# Altium schematic sheet 2012_BALISE_CARTE_PRINCIPALE.SchDoc
size 817 x 513 mm
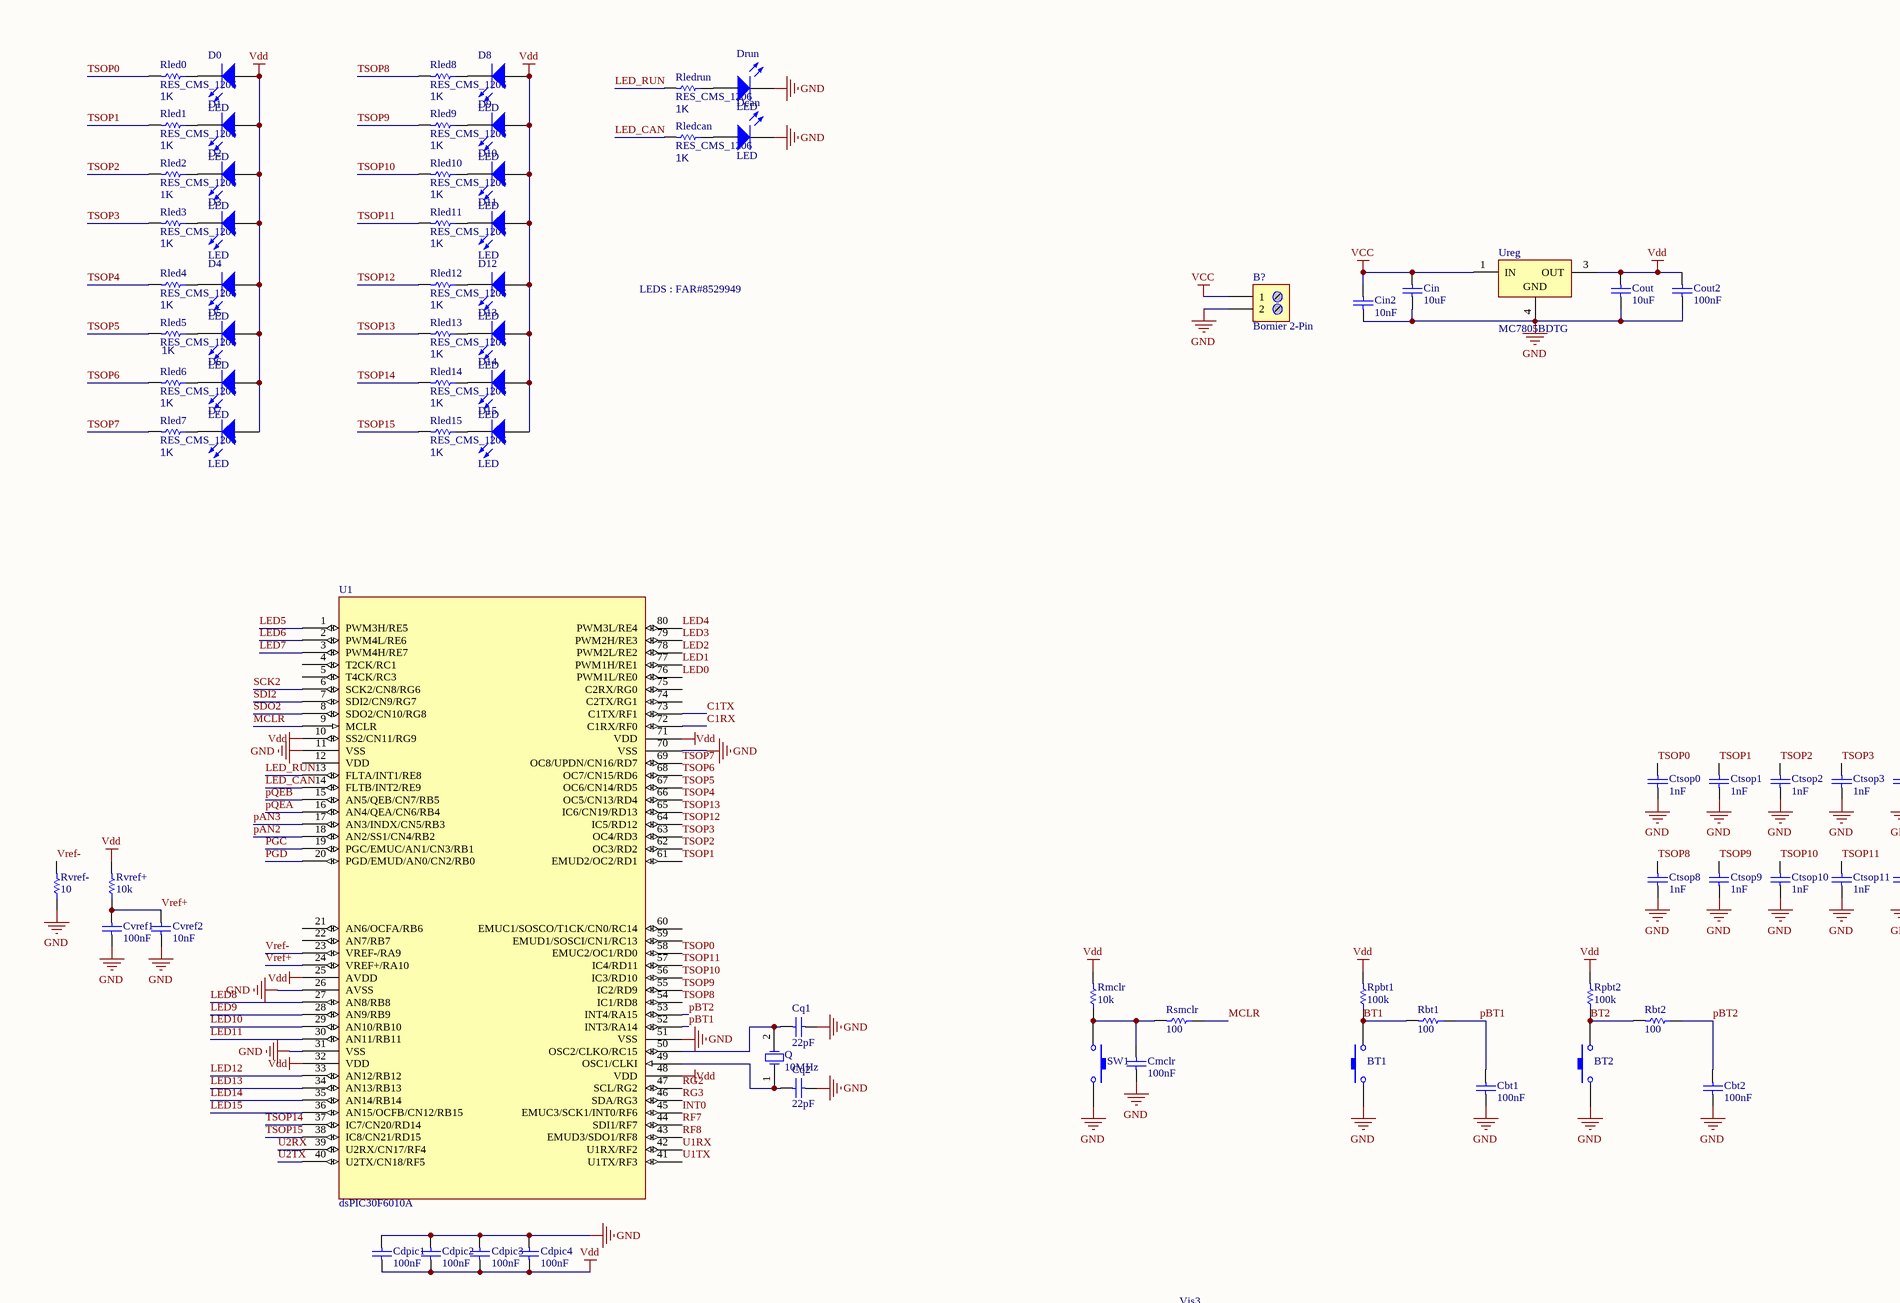
[diagram p0: 2012_BALISE_CARTE_PRINCIPALE.SchDoc, top left]
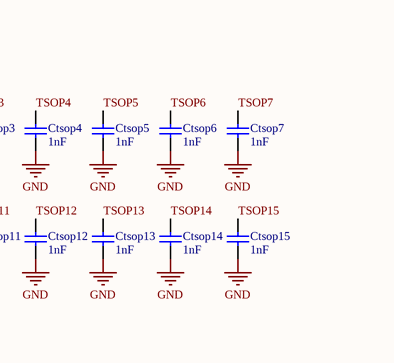
[diagram p1: 2012_BALISE_CARTE_PRINCIPALE.SchDoc, top right]
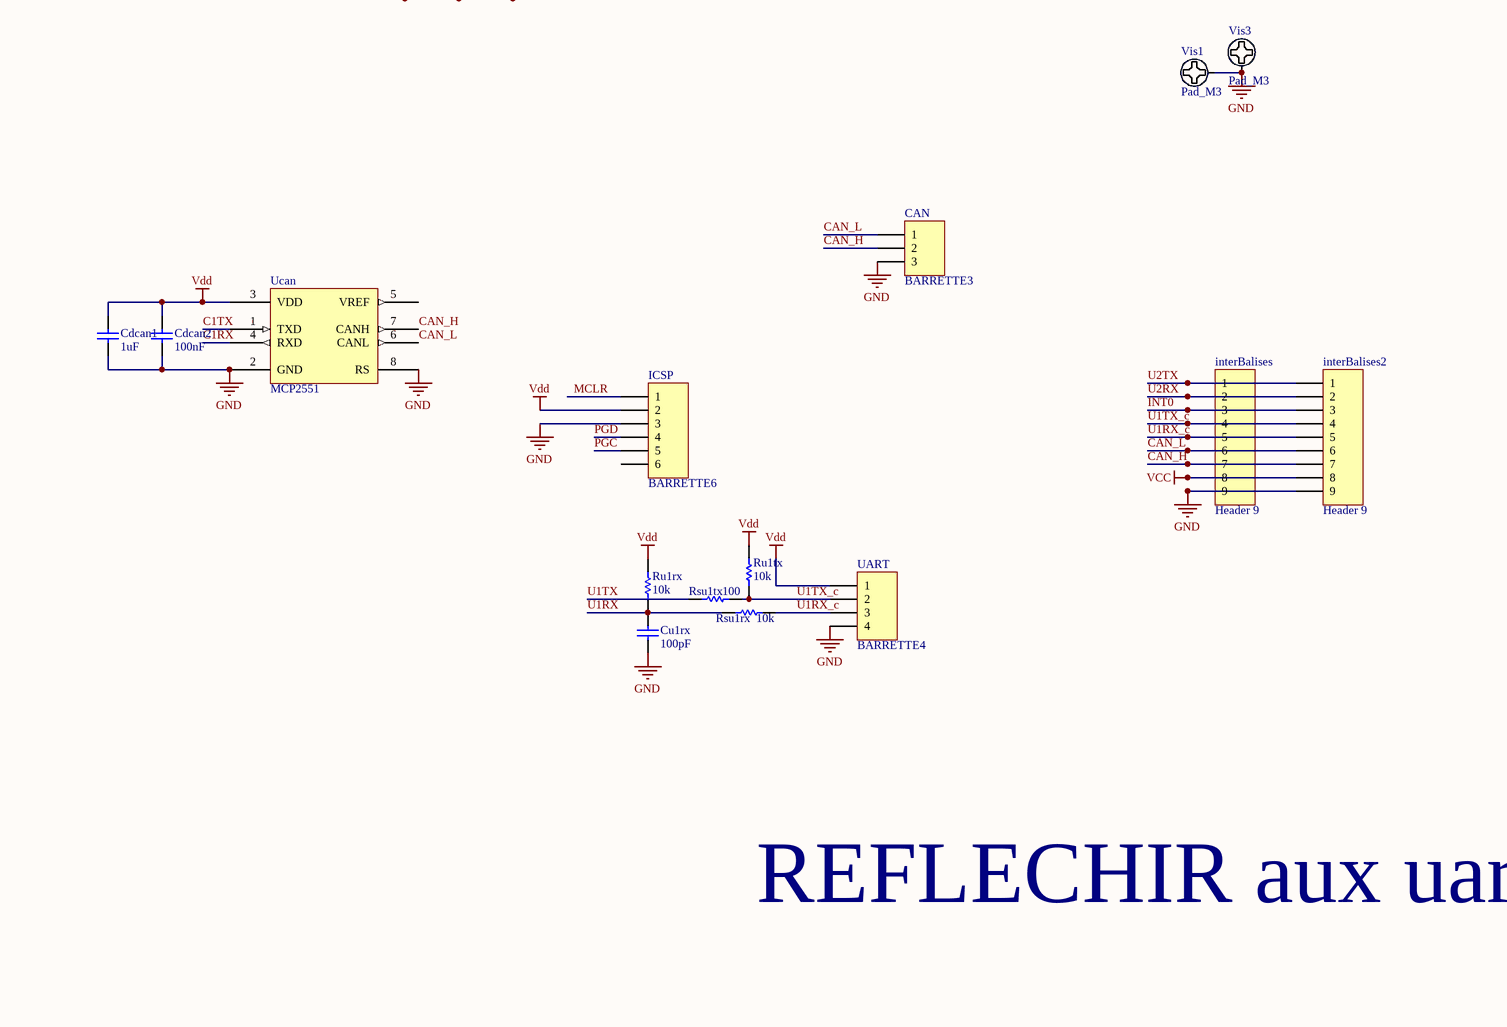
[diagram p2: 2012_BALISE_CARTE_PRINCIPALE.SchDoc, bottom left]
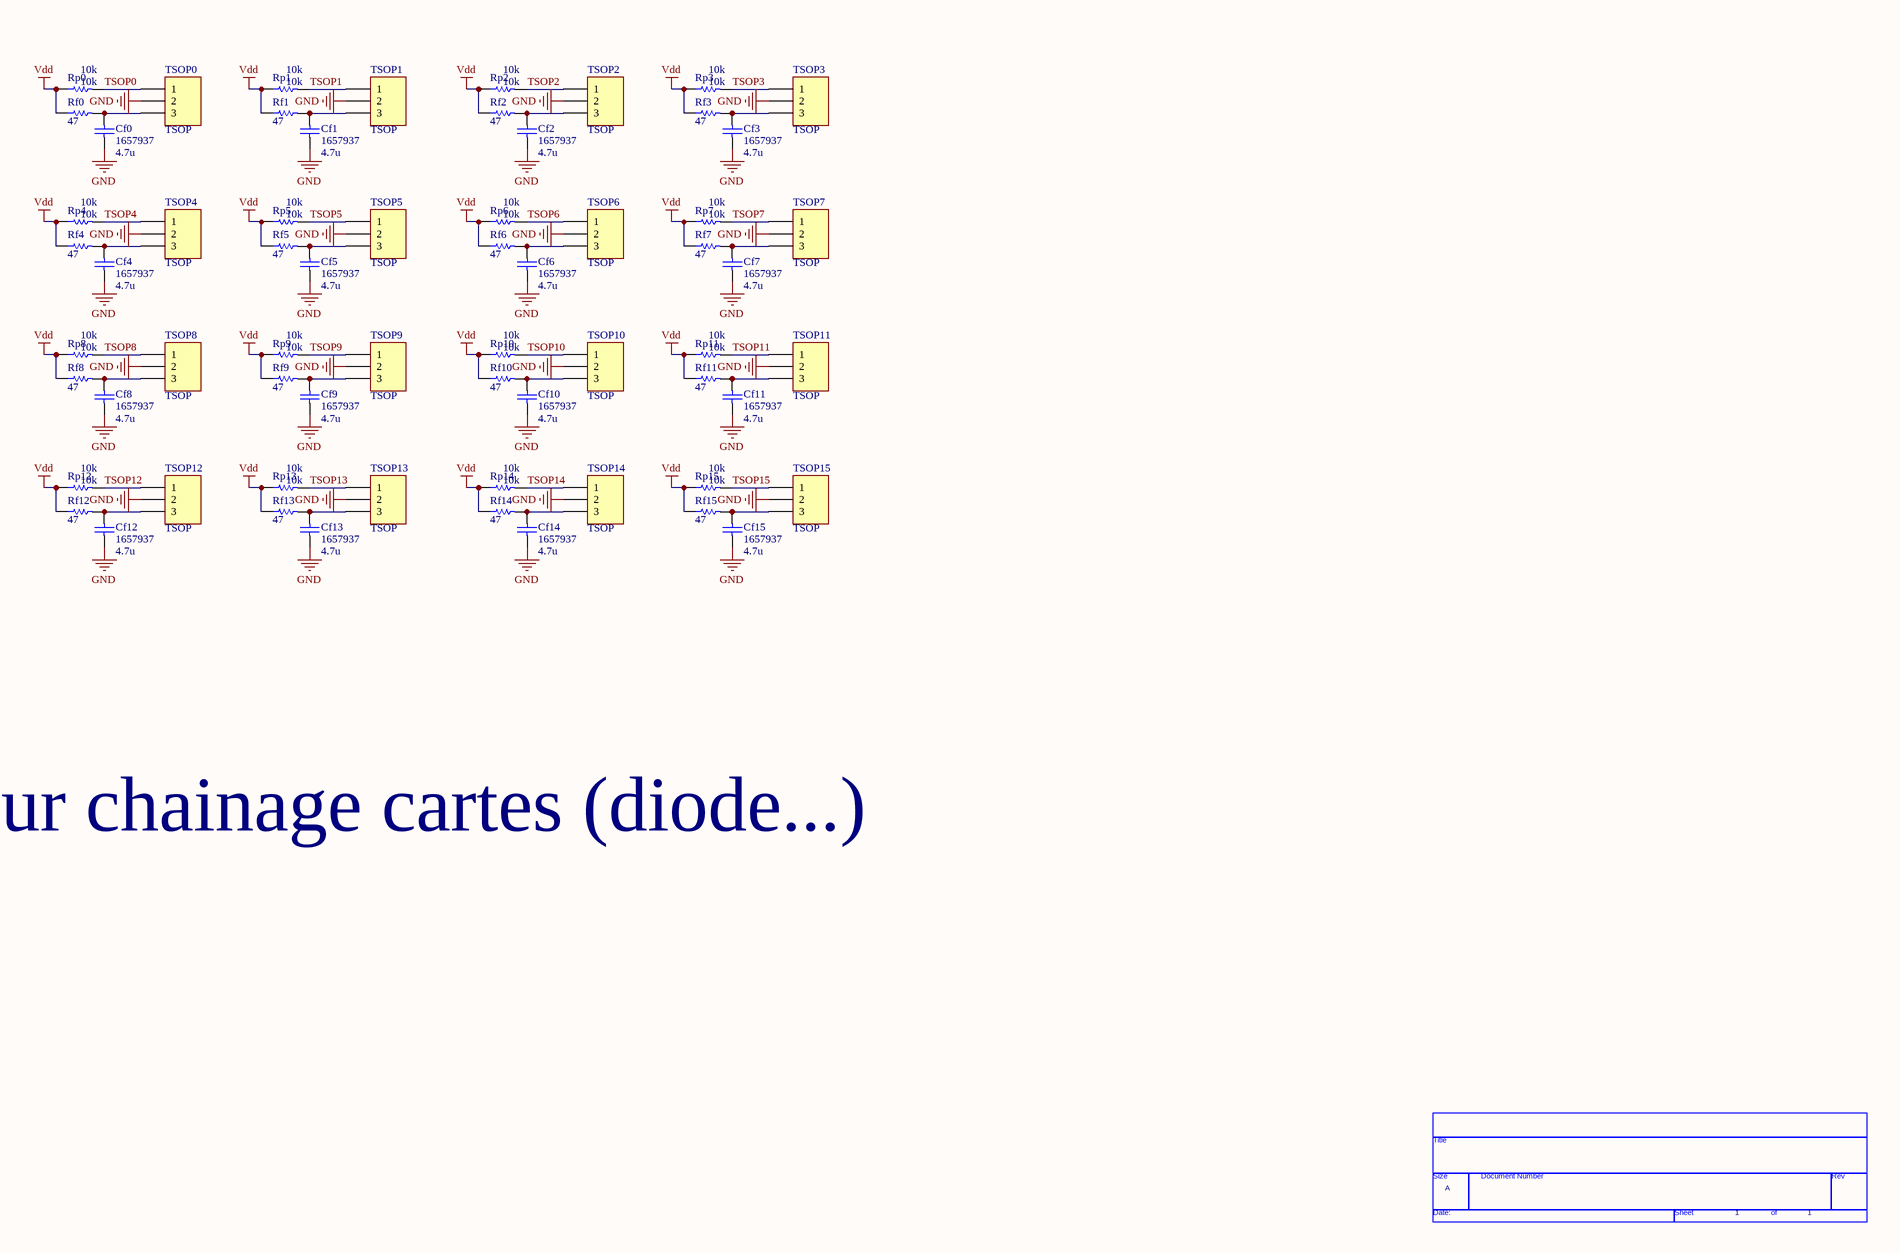
[diagram p3: 2012_BALISE_CARTE_PRINCIPALE.SchDoc, bottom right]

## Parts
*  Page Count: 1  Page Size: A  (hidden comment: TitleBlock0)  (graphical)
B?  Bornier 2-Pin  [Bornier_2]
BT1  SW_Pushbutton_6x6mm_Vertical  [Switch 6x6 Vertical]  (value not drawn)
BT2  SW_Pushbutton_6x6mm_Vertical  [Switch 6x6 Vertical]  (value not drawn)
CAN  BARRETTE3  [HDR1X3]
Cbt1  100nF  [C0805_N]
Cbt2  100nF  [C0805_N]
Cdcan1  1uF  [C1206_N]
Cdcan2  100nF  [C0805_N]
Cdpic1  100nF  [C0805_N]
Cdpic2  100nF  [C0805_N]
Cdpic3  100nF  [C0805_N]
Cdpic4  100nF  [C0805_N]
Cf0  1657937  value 4.7u  [C1206_N]
Cf1  1657937  value 4.7u  [C1206_N]
Cf2  1657937  value 4.7u  [C1206_N]
Cf3  1657937  value 4.7u  [C1206_N]
Cf4  1657937  value 4.7u  [C1206_N]
Cf5  1657937  value 4.7u  [C1206_N]
Cf6  1657937  value 4.7u  [C1206_N]
Cf7  1657937  value 4.7u  [C1206_N]
Cf8  1657937  value 4.7u  [C1206_N]
Cf9  1657937  value 4.7u  [C1206_N]
Cf10  1657937  value 4.7u  [C1206_N]
Cf11  1657937  value 4.7u  [C1206_N]
Cf12  1657937  value 4.7u  [C1206_N]
Cf13  1657937  value 4.7u  [C1206_N]
Cf14  1657937  value 4.7u  [C1206_N]
Cf15  1657937  value 4.7u  [C1206_N]
Cin  10uF  [C1206_N]
Cin2  10nF  [C0805_N]
Cmclr  100nF  [C0805_N]
Cout  10uF  [C1206_N]
Cout2  100nF  [C0805_N]
Cq1  22pF  [C0805_N]
Cq2  22pF  [C0805_N]
Ctsop0  1nF  [C0805_N]
Ctsop1  1nF  [C0805_N]
Ctsop2  1nF  [C0805_N]
Ctsop3  1nF  [C0805_N]
Ctsop4  1nF  [C0805_N]
Ctsop5  1nF  [C0805_N]
Ctsop6  1nF  [C0805_N]
Ctsop7  1nF  [C0805_N]
Ctsop8  1nF  [C0805_N]
Ctsop9  1nF  [C0805_N]
Ctsop10  1nF  [C0805_N]
Ctsop11  1nF  [C0805_N]
Ctsop12  1nF  [C0805_N]
Ctsop13  1nF  [C0805_N]
Ctsop14  1nF  [C0805_N]
Ctsop15  1nF  [C0805_N]
Cu1rx  100pF  [C0805_N]
Cvref1  100nF  [C0805_N]
Cvref2  10nF  [C0805_N]
D0  LED  [LED_0805]
D1  LED  [LED_0805]
D2  LED  [LED_0805]
D3  LED  [LED_0805]
D4  LED  [LED_0805]
D5  LED  [LED_0805]
D6  LED  [LED_0805]
D7  LED  [LED_0805]
D8  LED  [LED_0805]
D9  LED  [LED_0805]
D10  LED  [LED_0805]
D11  LED  [LED_0805]
D12  LED  [LED_0805]
D13  LED  [LED_0805]
D14  LED  [LED_0805]
D15  LED  [LED_0805]
Dcan  LED  [LED_0805]
Drun  LED  [LED_0805]
ICSP  BARRETTE6  [HDR1X6]
interBalises  Header 9  [HDR1X9]
interBalises2  Header 9  [HDR1X9]
Q  10MHz  [HC49US]
Rbt1  100  [R1206_N]
Rbt2  100  [R1206_N]
Rf0  47  [R1206_N]
Rf1  47  [R1206_N]
Rf2  47  [R1206_N]
Rf3  47  [R1206_N]
Rf4  47  [R1206_N]
Rf5  47  [R1206_N]
Rf6  47  [R1206_N]
Rf7  47  [R1206_N]
Rf8  47  [R1206_N]
Rf9  47  [R1206_N]
Rf10  47  [R1206_N]
Rf11  47  [R1206_N]
Rf12  47  [R1206_N]
Rf13  47  [R1206_N]
Rf14  47  [R1206_N]
Rf15  47  [R1206_N]
Rled0  RES_CMS_1206  value 1K  [R1206_N]
Rled1  RES_CMS_1206  value 1K  [R1206_N]
Rled2  RES_CMS_1206  value 1K  [R1206_N]
Rled3  RES_CMS_1206  value 1K  [R1206_N]
Rled4  RES_CMS_1206  value 1K  [R1206_N]
Rled5  RES_CMS_1206  value 1K  [R1206_N]
Rled6  RES_CMS_1206  value 1K  [R1206_N]
Rled7  RES_CMS_1206  value 1K  [R1206_N]
Rled8  RES_CMS_1206  value 1K  [R1206_N]
Rled9  RES_CMS_1206  value 1K  [R1206_N]
Rled10  RES_CMS_1206  value 1K  [R1206_N]
Rled11  RES_CMS_1206  value 1K  [R1206_N]
Rled12  RES_CMS_1206  value 1K  [R1206_N]
Rled13  RES_CMS_1206  value 1K  [R1206_N]
Rled14  RES_CMS_1206  value 1K  [R1206_N]
Rled15  RES_CMS_1206  value 1K  [R1206_N]
Rledcan  RES_CMS_1206  value 1K  [R1206_N]
Rledrun  RES_CMS_1206  value 1K  [R1206_N]
Rmclr  10k  [R1206_N]
Rp0  10k  [R1206_N]
Rp1  10k  [R1206_N]
Rp2  10k  [R1206_N]
Rp3  10k  [R1206_N]
Rp4  10k  [R1206_N]
Rp5  10k  [R1206_N]
Rp6  10k  [R1206_N]
Rp7  10k  [R1206_N]
Rp8  10k  [R1206_N]
Rp9  10k  [R1206_N]
Rp10  10k  [R1206_N]
Rp11  10k  [R1206_N]
Rp12  10k  [R1206_N]
Rp13  10k  [R1206_N]
Rp14  10k  [R1206_N]
Rp15  10k  [R1206_N]
Rpbt1  100k  [R1206_N]
Rpbt2  100k  [R1206_N]
Rsmclr  100  [R1206_N]
Rsu1rx  10k  [R1206_N]
Rsu1tx  100  [R1206_N]
Ru1rx  10k  [R1206_N]
Ru1tx  10k  [R1206_N]
Rvref+  10k  [R1206_N]
Rvref-  10  [R1206_N]
SW1  SW_Pushbutton_6x6mm_Vertical  [Switch 6x6 Vertical]  (value not drawn)
TSOP0  TSOP  [HDR1X3]
TSOP1  TSOP  [HDR1X3]
TSOP2  TSOP  [HDR1X3]
TSOP3  TSOP  [HDR1X3]
TSOP4  TSOP  [HDR1X3]
TSOP5  TSOP  [HDR1X3]
TSOP6  TSOP  [HDR1X3]
TSOP7  TSOP  [HDR1X3]
TSOP8  TSOP  [HDR1X3]
TSOP9  TSOP  [HDR1X3]
TSOP10  TSOP  [HDR1X3]
TSOP11  TSOP  [HDR1X3]
TSOP12  TSOP  [HDR1X3]
TSOP13  TSOP  [HDR1X3]
TSOP14  TSOP  [HDR1X3]
TSOP15  TSOP  [HDR1X3]
U1  dsPIC30F6010A  [TQFP80_N]
UART  BARRETTE4  [HDR1X4]
Ucan  MCP2551  [SOIC150-8_N]
Ureg  MC7805BDTG  [369A-13]
Vis1  Pad_M3  [M3x6mm]
Vis3  Pad_M3  [M3x6mm]

## Nets
GND: B?.2 BT1.1 BT2.1 CAN.3 Cbt1.1 Cbt2.1 Cdcan1.1 Cdcan2.1 Cdpic1.2 Cdpic2.2 Cdpic3.2 Cdpic4.2 Cf0.1 Cf1.1 Cf2.1 Cf3.1 Cf4.1 Cf5.1 Cf6.1 Cf7.1 Cf8.1 Cf9.1 Cf10.1 Cf11.1 Cf12.1 Cf13.1 Cf14.1 Cf15.1 Cin.1 Cin2.1 Cmclr.1 Cout.1 Cout2.1 Cq1.2 Cq2.2 Ctsop0.2 Ctsop1.2 Ctsop2.2 Ctsop3.2 Ctsop4.2 Ctsop5.2 Ctsop6.2 Ctsop7.2 Ctsop8.2 Ctsop9.2 Ctsop10.2 Ctsop11.2 Ctsop12.2 Ctsop13.2 Ctsop14.2 Ctsop15.2 Cu1rx.1 Cvref1.1 Cvref2.1 Dcan.2(K) Drun.2(K) ICSP.3 interBalises.9 interBalises2.9 Rvref-.1 SW1.3 TSOP0.2 TSOP1.2 TSOP2.2 TSOP3.2 TSOP4.2 TSOP5.2 TSOP6.2 TSOP7.2 TSOP8.2 TSOP9.2 TSOP10.2 TSOP11.2 TSOP12.2 TSOP13.2 TSOP14.2 TSOP15.2 U1.11(VSS) U1.26(AVSS) U1.31(VSS) U1.51(VSS) U1.70(VSS) UART.4 Ucan.2(GND) Ucan.8(RS) Ureg.4(GND) Vis1.1 Vis3.1
VCC: B?.1 Cin.2 Cin2.2 interBalises.8 interBalises2.8 Ureg.1(IN)
Vdd: Cdcan1.2 Cdcan2.2 Cdpic1.1 Cdpic2.1 Cdpic3.1 Cdpic4.1 Cout.2 Cout2.2 D0.1(A) D1.1(A) D2.1(A) D3.1(A) D4.1(A) D5.1(A) D6.1(A) D7.1(A) D8.1(A) D9.1(A) D10.1(A) D11.1(A) D12.1(A) D13.1(A) D14.1(A) D15.1(A) ICSP.2 Rf0.1 Rf1.1 Rf2.1 Rf3.1 Rf4.1 Rf5.1 Rf6.1 Rf7.1 Rf8.1 Rf9.1 Rf10.1 Rf11.1 Rf12.1 Rf13.1 Rf14.1 Rf15.1 Rmclr.2 Rp0.1 Rp1.1 Rp2.1 Rp3.1 Rp4.1 Rp5.1 Rp6.1 Rp7.1 Rp8.1 Rp9.1 Rp10.1 Rp11.1 Rp12.1 Rp13.1 Rp14.1 Rp15.1 Rpbt1.2 Rpbt2.2 Ru1rx.2 Ru1tx.2 Rvref+.2 U1.10(SS2/CN11/RG9) U1.25(AVDD) U1.32(VDD) U1.48(VDD) U1.71(VDD) UART.1 Ucan.3(VDD) Ureg.3(OUT)
BT1: BT1.3 Rbt1.2 Rpbt1.1
BT2: BT2.3 Rbt2.2 Rpbt2.1
C1RX: U1.72(C1RX/RF0) Ucan.4(RXD)
C1TX: U1.73(C1TX/RF1) Ucan.1(TXD)
CAN_H: CAN.2 interBalises.7 interBalises2.7 Ucan.7(CANH)
CAN_L: CAN.1 interBalises.6 interBalises2.6 Ucan.6(CANL)
INT0: interBalises.3 interBalises2.3 U1.45(EMUC3/SCK1/INT0/RF6)
LED0: U1.76(PWM1L/RE0)
LED1: U1.77(PWM1H/RE1)
LED2: U1.78(PWM2L/RE2)
LED3: U1.79(PWM2H/RE3)
LED4: U1.80(PWM3L/RE4)
LED5: U1.1(PWM3H/RE5)
LED6: U1.2(PWM4L/RE6)
LED7: U1.3(PWM4H/RE7)
LED8: U1.27(AN8/RB8)
LED9: U1.28(AN9/RB9)
LED10: U1.29(AN10/RB10)
LED11: U1.30(AN11/RB11)
LED12: U1.33(AN12/RB12)
LED13: U1.34(AN13/RB13)
LED14: U1.35(AN14/RB14)
LED15: U1.36(AN15/OCFB/CN12/RB15)
LED_CAN: Rledcan.2 U1.14(FLTB/INT2/RE9)
LED_RUN: Rledrun.2 U1.13(FLTA/INT1/RE8)
MCLR: ICSP.1 Rsmclr.1 U1.9(MCLR)
pAN2: U1.18(AN2/SS1/CN4/RB2)
pAN3: U1.17(AN3/INDX/CN5/RB3)
pBT1: Cbt1.2 Rbt1.1 U1.52(INT3/RA14)
pBT2: Cbt2.2 Rbt2.1 U1.53(INT4/RA15)
PGC: ICSP.5 U1.19(PGC/EMUC/AN1/CN3/RB1)
PGD: ICSP.4 U1.20(PGD/EMUD/AN0/CN2/RB0)
pQEA: U1.16(AN4/QEA/CN6/RB4)
pQEB: U1.15(AN5/QEB/CN7/RB5)
RF7: U1.44(SDI1/RF7)
RF8: U1.43(EMUD3/SDO1/RF8)
RG2: U1.47(SCL/RG2)
RG3: U1.46(SDA/RG3)
SCK2: U1.6(SCK2/CN8/RG6)
SDI2: U1.7(SDI2/CN9/RG7)
SDO2: U1.8(SDO2/CN10/RG8)
TSOP0: Ctsop0.1 Rled0.2 Rp0.2 TSOP0.1 U1.58(EMUC2/OC1/RD0)
TSOP1: Ctsop1.1 Rled1.2 Rp1.2 TSOP1.1 U1.61(EMUD2/OC2/RD1)
TSOP2: Ctsop2.1 Rled2.2 Rp2.2 TSOP2.1 U1.62(OC3/RD2)
TSOP3: Ctsop3.1 Rled3.2 Rp3.2 TSOP3.1 U1.63(OC4/RD3)
TSOP4: Ctsop4.1 Rled4.2 Rp4.2 TSOP4.1 U1.66(OC5/CN13/RD4)
TSOP5: Ctsop5.1 Rled5.2 Rp5.2 TSOP5.1 U1.67(OC6/CN14/RD5)
TSOP6: Ctsop6.1 Rled6.2 Rp6.2 TSOP6.1 U1.68(OC7/CN15/RD6)
TSOP7: Ctsop7.1 Rled7.2 Rp7.2 TSOP7.1 U1.69(OC8/UPDN/CN16/RD7)
TSOP8: Ctsop8.1 Rled8.2 Rp8.2 TSOP8.1 U1.54(IC1/RD8)
TSOP9: Ctsop9.1 Rled9.2 Rp9.2 TSOP9.1 U1.55(IC2/RD9)
TSOP10: Ctsop10.1 Rled10.2 Rp10.2 TSOP10.1 U1.56(IC3/RD10)
TSOP11: Ctsop11.1 Rled11.2 Rp11.2 TSOP11.1 U1.57(IC4/RD11)
TSOP12: Ctsop12.1 Rled12.2 Rp12.2 TSOP12.1 U1.64(IC5/RD12)
TSOP13: Ctsop13.1 Rled13.2 Rp13.2 TSOP13.1 U1.65(IC6/CN19/RD13)
TSOP14: Ctsop14.1 Rled14.2 Rp14.2 TSOP14.1 U1.37(IC7/CN20/RD14)
TSOP15: Ctsop15.1 Rled15.2 Rp15.2 TSOP15.1 U1.38(IC8/CN21/RD15)
U1RX: Cu1rx.2 Rsu1rx.2 Ru1rx.1 U1.42(U1RX/RF2)
U1RX_c: interBalises.5 interBalises2.5 Rsu1rx.1 UART.3
U1TX: Rsu1tx.2 U1.41(U1TX/RF3)
U1TX_c: interBalises.4 interBalises2.4 Rsu1tx.1 Ru1tx.1 UART.2
U2RX: interBalises.2 interBalises2.2 U1.39(U2RX/CN17/RF4)
U2TX: interBalises.1 interBalises2.1 U1.40(U2TX/CN18/RF5)
Vref+: Cvref1.2 Cvref2.2 Rvref+.1 U1.24(VREF+/RA10)
Vref-: Rvref-.2 U1.23(VREF-/RA9)
NetCf0_2: Cf0.2 Rf0.2 TSOP0.3
NetCf1_2: Cf1.2 Rf1.2 TSOP1.3
NetCf2_2: Cf2.2 Rf2.2 TSOP2.3
NetCf3_2: Cf3.2 Rf3.2 TSOP3.3
NetCf4_2: Cf4.2 Rf4.2 TSOP4.3
NetCf5_2: Cf5.2 Rf5.2 TSOP5.3
NetCf6_2: Cf6.2 Rf6.2 TSOP6.3
NetCf7_2: Cf7.2 Rf7.2 TSOP7.3
NetCf8_2: Cf8.2 Rf8.2 TSOP8.3
NetCf9_2: Cf9.2 Rf9.2 TSOP9.3
NetCf10_2: Cf10.2 Rf10.2 TSOP10.3
NetCf11_2: Cf11.2 Rf11.2 TSOP11.3
NetCf12_2: Cf12.2 Rf12.2 TSOP12.3
NetCf13_2: Cf13.2 Rf13.2 TSOP13.3
NetCf14_2: Cf14.2 Rf14.2 TSOP14.3
NetCf15_2: Cf15.2 Rf15.2 TSOP15.3
NetCmclr_2: Cmclr.2 Rmclr.1 Rsmclr.2 SW1.1
NetCq1_1: Cq1.1 Q.2(OSC2) U1.50(OSC2/CLKO/RC15)
NetCq2_1: Cq2.1 Q.1(OSC1) U1.49(OSC1/CLKI)
NetD0_2: D0.2(K) Rled0.1
NetD1_2: D1.2(K) Rled1.1
NetD2_2: D2.2(K) Rled2.1
NetD3_2: D3.2(K) Rled3.1
NetD4_2: D4.2(K) Rled4.1
NetD5_2: D5.2(K) Rled5.1
NetD6_2: D6.2(K) Rled6.1
NetD7_2: D7.2(K) Rled7.1
NetD8_2: D8.2(K) Rled8.1
NetD9_2: D9.2(K) Rled9.1
NetD10_2: D10.2(K) Rled10.1
NetD11_2: D11.2(K) Rled11.1
NetD12_2: D12.2(K) Rled12.1
NetD13_2: D13.2(K) Rled13.1
NetD14_2: D14.2(K) Rled14.1
NetD15_2: D15.2(K) Rled15.1
NetDcan_1: Dcan.1(A) Rledcan.1
NetDrun_1: Drun.1(A) Rledrun.1

Not connected (* = marked no-connect by the designer): ICSP 6; U1 4(T2CK/RC1) 5(T4CK/RC3) 12(VDD) 21(AN6/OCFA/RB6) 22(AN7/RB7) 59(EMUD1/SOSCI/CN1/RC13) 60(EMUC1/SOSCO/T1CK/CN0/RC14) 74(C2TX/RG1) 75(C2RX/RG0); Ucan 5(VREF)

## Notes on the sheet
- LEDS : FAR#8529949
- REFLECHIR aux uart multiples pour chainage cartes (diode...)
- (in symbol TitleBlock0) Title; Size; Document Number; Rev; Date:; Sheet; of

## Library data of the parts
BT1 BT2 SW1 = SW_Pushbutton_6x6mm_Vertical: Switch tactil 6mm x 6mm Vertical; Published: 27/11/09; PackageReference: 6mm X 6mm; Publisher: Damien Guitton
CAN TSOP0-TSOP15 = BARRETTE3: Header, 3-Pin; LatestRevisionDate: 17-Jul-2002; LatestRevisionNote: Re-released for DXP Platform.; Publisher: Altium Limited
Cbt1 Cbt2 Cdcan1 Cdcan2 Cdpic1-Cdpic4 Cin Cin2 Cmclr Cout Cout2 Cq1 Cq2 Ctsop0-Ctsop15 Cu1rx Cvref1 Cvref2 = Capacitor: Published: 8-Jun-2000; LatestRevisionDate: 17-Jul-2002; LatestRevisionNote: Re-released for DXP Platform.; PackageReference: RAD-0.3; Publisher: Altium Limited
Cf0-Cf15 = CONDENSATEUR: Capacitor; Published: 8-Jun-2000; LatestRevisionDate: 17-Jul-2002; LatestRevisionNote: Re-released for DXP Platform.; PackageReference: RAD-0.3; Publisher: Altium Limited
D0-D15 Dcan Drun = LED: Typical LED; Published: 8-Jun-2000; LatestRevisionDate: 08-Jul-2005; LatestRevisionNote: Mech Layer 1 removed.; PackageReference: LED-1; Publisher: Altium Limited
ICSP = BARRETTE6: Header, 6-Pin; LatestRevisionDate: 17-Jul-2002; LatestRevisionNote: Re-released for DXP Platform.; Publisher: Altium Limited
interBalises interBalises2 = Header 9: Header, 9-Pin; LatestRevisionDate: 17-Jul-2002; LatestRevisionNote: Re-released for DXP Platform.; Publisher: Altium Limited
Q = Quartz: Crystal Oscillator; Published: 8-Jun-2000; LatestRevisionDate: 17-Jul-2002; LatestRevisionNote: Re-released for DXP Platform.; PackageReference: R38; Publisher: Altium Limited
Rbt1 Rbt2 Rmclr Rpbt1 Rpbt2 Rsmclr Rsu1rx Rsu1tx Ru1rx Ru1tx Rvref+ Rvref- = Resistor: Published: 8-Jun-2000; LatestRevisionDate: 17-Jul-2002; LatestRevisionNote: Re-released for DXP Platform.; PackageReference: AXIAL-0.5; Publisher: Altium Limited
Rf0-Rf15 Rled2 Rp0-Rp15 = RESISTANCE: Resistor; Published: 8-Jun-2000; LatestRevisionDate: 17-Jul-2002; LatestRevisionNote: Re-released for DXP Platform.; PackageReference: AXIAL-0.3; Publisher: Altium Limited
  Rp0-Rp15: Value: 10k
Rled0 Rled1 Rled3-Rled15 Rledcan Rledrun = RESISTANCE_CMS_1206: Resistor; Published: 8-Jun-2000; LatestRevisionDate: 17-Jul-2002; LatestRevisionNote: Re-released for DXP Platform.; PackageReference: AXIAL-0.3; Publisher: Altium Limited; Type: CMS
U1 = dsPIC30F6010A: High-Performance, 16-bit Digital Signal Controllers
UART = BARRETTE4: Header, 4-Pin; LatestRevisionDate: 17-Jul-2002; LatestRevisionNote: Re-released for DXP Platform.; Publisher: Altium Limited
Ucan = MCP2551: High Speed Can Transceiver; Published: 6-Oct-2005; LatestRevisionDate: 13-Apr-2006; LatestRevisionNote: IPC-7351 Footprint Added.; DatasheetVersion: Nov-2003; PackageVersion: Oct-2005; PackageReference: SOIC150-8; Publisher: Altium Limited; PackageDescription: 8-Pin Plastic Narrow Body Small Outline Integrated Circuit 1.27 mm Pitch; Code_JEDEC: MS-012; ComponentLink1Description: Manufacturer Link; ComponentLink1URL: http://www.microchip.com; ComponentLink2Description: Datasheet; ComponentLink2URL: http://ww1.microchip.com/downloads/en/DeviceDoc/21667d.pdf
Ureg = MC7805ACD2T: Three-Terminal Positive Voltage Regulator; Note: Pin 2 is electrically connected to Pin 4; Pin 2 is trimmed and not drawn;; Published: 15-Apr-2002; DatasheetVersion: 1997; PackageVersion: 1997; PackageReference: 936-03; Publisher: Altium Limited; PackageDescription: D2-PAK/TO-263-AB; 3 Leads (1 Cropped); Body 14.7 (inc. leads) x 10.2 mm (LxW max); ComponentLink1Description: Manufacturer Link; ComponentLink1URL: http://www.onsemi.com/site/products/taxonomy/0,4438,503,00.html; ComponentLink2Description: Datasheet; ComponentLink2URL: http://www.onsemi.com/pub/Collateral/MC7800-D.PDF
Vis1 Vis3 = Vis M3 X 6mm _TORX_Tête 6mm: Publisher: Damien Guitton
* = TitleBlock0: Page Number: 1; Page Create Date: March  8, 1995
B? = Bornier 2-Pin: LatestRevisionDate: 17-Jul-2002; LatestRevisionNote: Re-released for DXP Platform.; Publisher: Altium Limited